# EAGLE design dev-board (EAGLE 7.1.0)
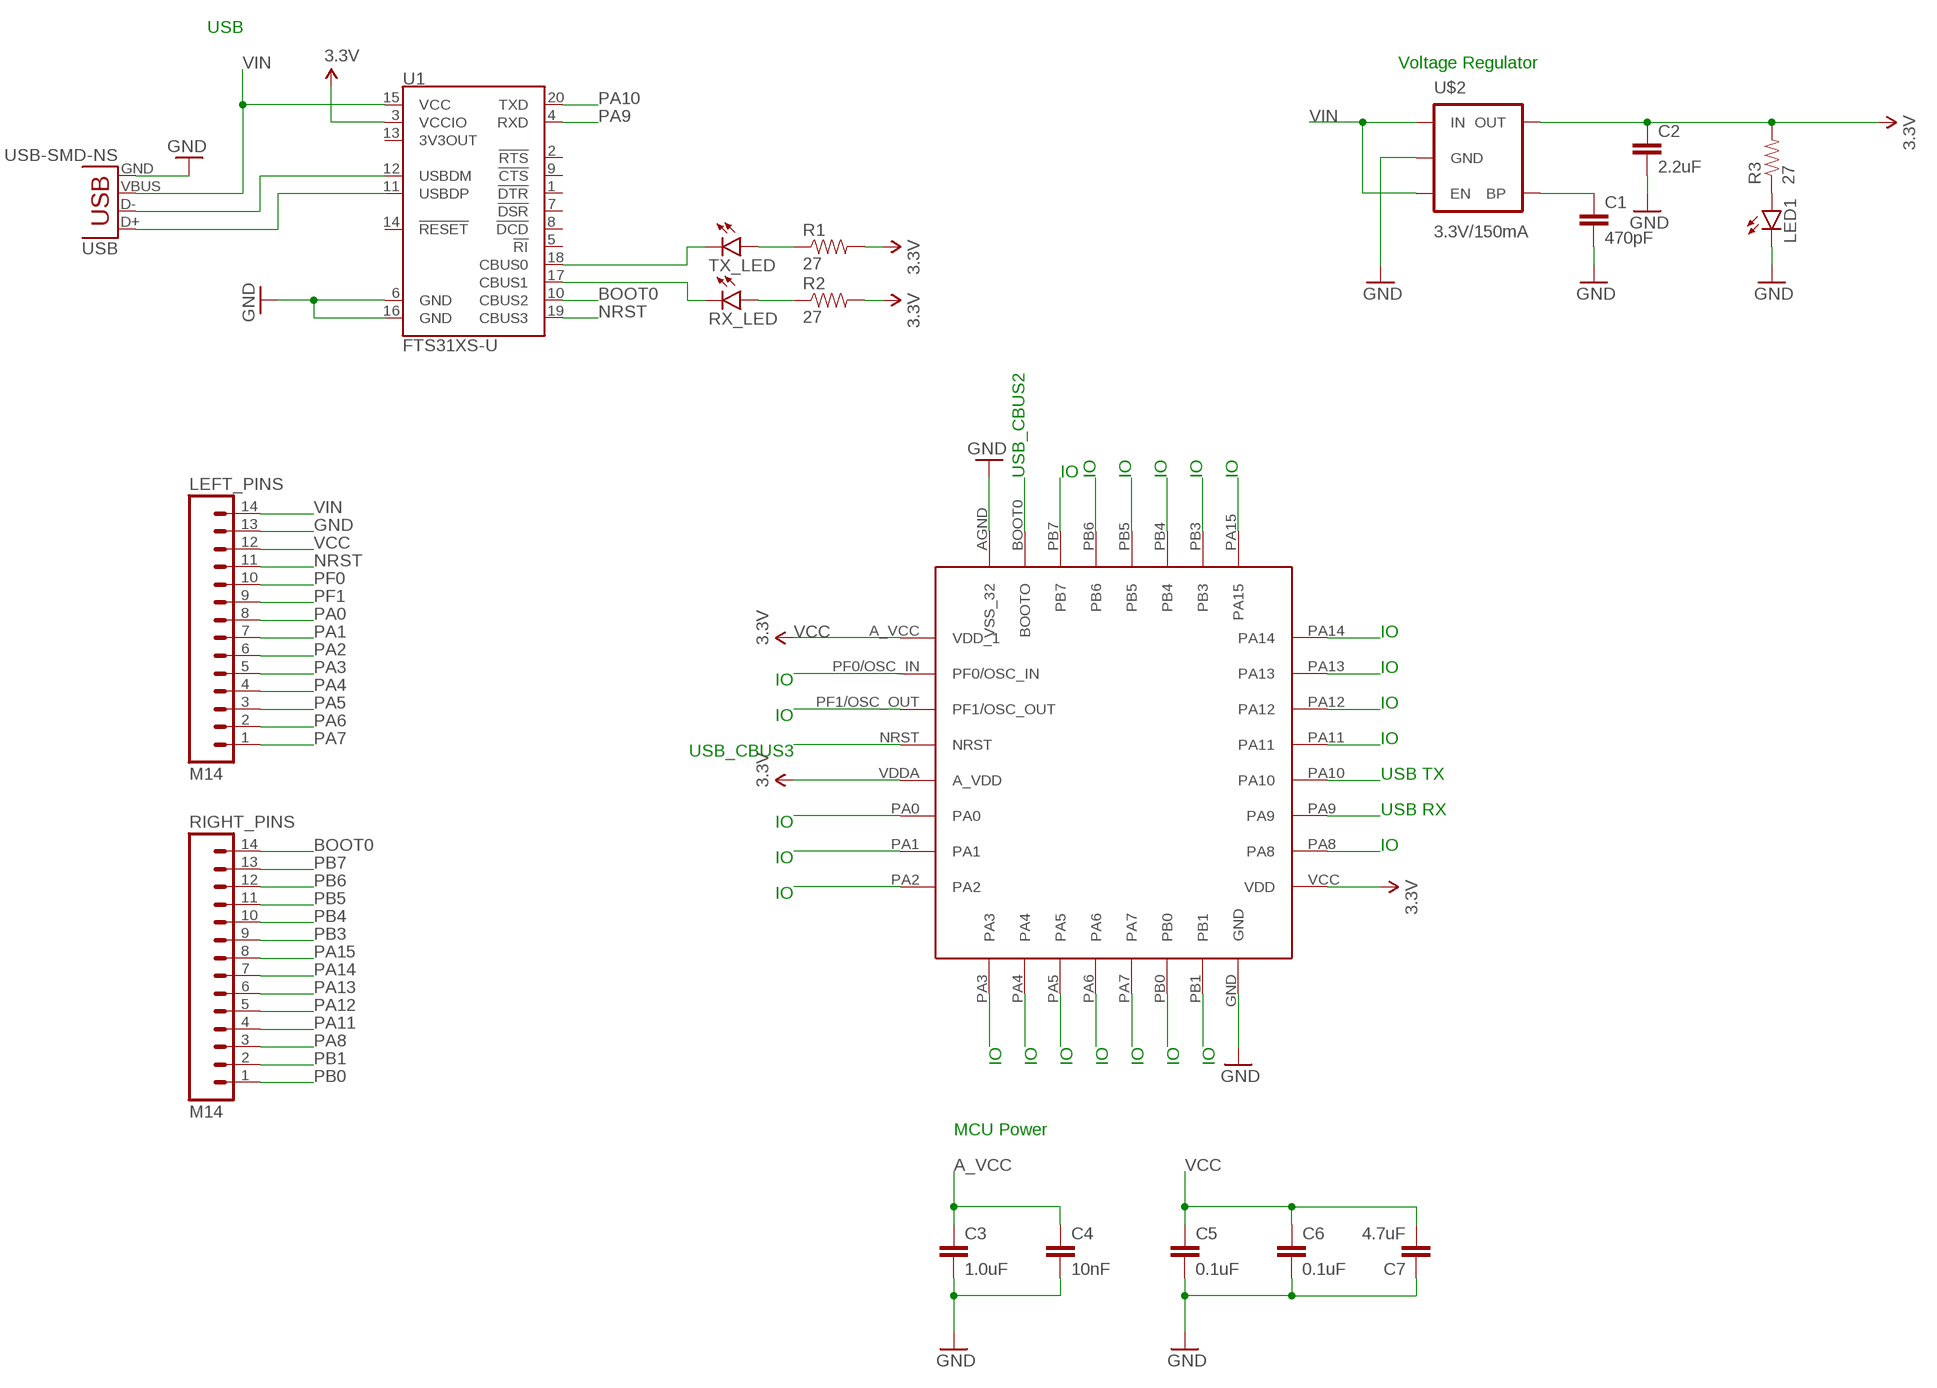
[diagram p0: schematic, sheet 1]

## Parts
C1  470pF  470PF-50V-5%(0603)SMD  [0603-CAP]
C2  2.2uF  2.2UF-10V-20%(0603)  [0603-CAP]
C3  1.0uF  1.0UF-16V-10%(0603)  [0603-CAP]
C4  10nF  10NF/10000PF-50V-10%(0603)  [0603-CAP]
C5  0.1uF  0.1UF-16V(+-10%)(0402)  [0402-CAP]
C6  0.1uF  0.1UF-16V(+-10%)(0402)  [0402-CAP]
C7  4.7uF  4.7UF-6.3V-10%(0603)0603  [0603-CAP]
LED1  LED1206  [LED-1206]
LEFT_PINS  M14  [1X14]
R1  27  27OHM1/10W1%(0603)  [0603]
R2  27  27OHM1/10W1%(0603)  [0603]
R3  27  27OHM1/10W1%(0603)  [0603]
RIGHT_PINS  M14  [1X14]
RX_LED  LED1206  [LED-1206]
TX_LED  LED1206  [LED-1206]
U1  FTS31XS-U  FT231XS  [SSOP20_L]
U$1  STM32F051XX  [STM32F051-LQFP-32]
U$2  3.3V/150mA  V_REG_MIC52053.3V  [SOT23-5]
USB  USB-SMD-NS  [USB-MINIB-NOSTOP]

## Nets
A_VCC: C3.1 C4.1 U$1.VDDA(A_VDD) ; supply symbol labelled 3.3V
BOOT0: RIGHT_PINS.14 U1.10(CBUS2) U$1.BOOT0(BOOTO)
GND: C1.2 C2.2 C3.2 C4.2 C5.2 C6.2 C7.1 LED1.C LEFT_PINS.13 U1.6(GND) U1.16(GND) U$1.AGND(VSS_32) U$1.GND U$2.2(GND) USB.GND
N$1: RX_LED.C U1.17(CBUS1)
N$2: TX_LED.C U1.18(CBUS0)
N$3: R1.1 TX_LED.A
N$4: R2.1 RX_LED.A
N$5: LED1.A R3.1
N$37: C1.1 U$2.4(BP)
NRST: LEFT_PINS.11 U1.19(CBUS3) U$1.NRST
PA0: LEFT_PINS.8 U$1.PA0
PA1: LEFT_PINS.7 U$1.PA1
PA2: LEFT_PINS.6 U$1.PA2
PA3: LEFT_PINS.5 U$1.PA3
PA4: LEFT_PINS.4 U$1.PA4
PA5: LEFT_PINS.3 U$1.PA5
PA6: LEFT_PINS.2 U$1.PA6
PA7: LEFT_PINS.1 U$1.PA7
PA8: RIGHT_PINS.3 U$1.PA8
PA9: U1.4(RXD) U$1.PA9
PA10: U1.20(TXD) U$1.PA10
PA11: RIGHT_PINS.4 U$1.PA11
PA12: RIGHT_PINS.5 U$1.PA12
PA13: RIGHT_PINS.6 U$1.PA13
PA14: RIGHT_PINS.7 U$1.PA14
PA15: RIGHT_PINS.8 U$1.PA15
PB0: RIGHT_PINS.1 U$1.PB0
PB1: RIGHT_PINS.2 U$1.PB1
PB3: RIGHT_PINS.9 U$1.PB3
PB4: RIGHT_PINS.10 U$1.PB4
PB5: RIGHT_PINS.11 U$1.PB5
PB6: RIGHT_PINS.12 U$1.PB6
PB7: RIGHT_PINS.13 U$1.PB7
PF0: LEFT_PINS.10 U$1.PF0/OSC_IN
PF1: LEFT_PINS.9 U$1.PF1/OSC_OUT
USB_D+: U1.11(USBDP) USB.D+
USB_D-: U1.12(USBDM) USB.D-
VCC: C2.1 C5.1 C6.1 C7.2 LEFT_PINS.12 R1.2 R2.2 R3.2 U1.3(VCCIO) U$1.A_VCC(VDD_1) U$1.VCC(VDD) U$2.5(OUT) ; supply symbol labelled 3.3V
VIN: LEFT_PINS.14 U1.15(VCC) U$2.1(IN) U$2.3(EN) USB.VBUS
Unconnected: U1.1(!DTR) U1.2(!RTS) U1.5(!RI) U1.7(!DSR) U1.8(!DCD) U1.9(!CTS) U1.13(3V3OUT) U1.14(!RESET)

## Notes on the sheet
- USB
- Voltage Regulator
- USB_CBUS2 | IO | IO | IO | IO | IO | IO
- IO
- IO | IO
- IO | IO
- USB_CBUS3 | IO
- USB TX
- IO | USB RX
- IO | IO
- IO
- IO | IO | IO | IO | IO | IO | IO
- MCU Power

## Library data of the parts
C1 = SparkFun-Capacitors:470PF-50V-5%(0603): CAP-07884; PROD_ID: CAP-07884
C2 = SparkFun-Capacitors:2.2UF-10V-20%(0603): CAP-07888; PROD_ID: CAP-07888
C3 = SparkFun-Capacitors:1.0UF-16V-10%(0603): CAP-00868; PROD_ID: CAP-00868
C4 = SparkFun-Capacitors:10NF/10000PF-50V-10%(0603): CAP-00867; PROD_ID: CAP-00867
C5 C6 = SparkFun-Capacitors:0.1UF-16V(+-10%)(0402); PROD_ID: CAP-12416
C7 = SparkFun-Capacitors:4.7UF-6.3V-10%(0603): CAP-08280; PROD_ID: CAP-08280
LED1 RX_LED TX_LED = SparkFun-LED:LED: LEDs Standard schematic elements and footprints for 5mm, 3mm, 1206, and 0603 sized LEDs. 5mm - Spark Fun Electronics SKU : COM-00529 (and others)
LEFT_PINS RIGHT_PINS = SparkFun-Connectors:M14: Header 14 Standard 14-pin 0.1" header. Use with straight break away headers (SKU : PRT-00116), right angle break away headers (PRT-00553), swiss pins (PRT-00743), machine pins (PRT-00117), and female headers (PRT-00115).
R1-R3 = SparkFun-Resistors:27OHM1/10W1%(0603): RES-09334; PROD_ID: RES-09334
U1 = SparkFun-DigitalIC:FT231X: FTDI FT231X Full Speed USB to Full-handshake UART This USB2.0 Full Speed IC offers a compact bridge to full handshake UART interfaces. The device is a UART, capable of operating up to 3MBaud, with low power consumption (8mA). The FT231X includes the complete FT-X series feature set and enables USB to be added into a system design quickly and easily over a UART interface.; PROD_ID: IC-11524
U$1 = jordan-lib:STM32F051XX
U$2 = SparkFun-PowerIC:V_REG_MIC5205: V_REG MIC5219 Standard 3.3V and 5V 150mA LDO voltage regulator in SOT-23 layout. Micrel part MIC5205. BP (by-pass) pin is used to lower output noise with 470pF cap, may be left open.; PROD_ID: VREG-00822
USB = SparkFun-Connectors:USB: USB Connectors USB-B-PTH is fully proven SKU : PRT-00139/CONN-08278 USB-miniB is fully proven SKU : PRT-00587 USB-A-PCB is untested. USB-A-H is throughly reviewed, but untested. Spark Fun Electronics SKU : PRT-00437 USB-B-SMT is throughly reviewed, but untested. Needs silkscreen touching up. USB-A-S has not been used/tested USB-MB-H has not been used/tested USB-MICROB has been used. CONN-09505

## Board
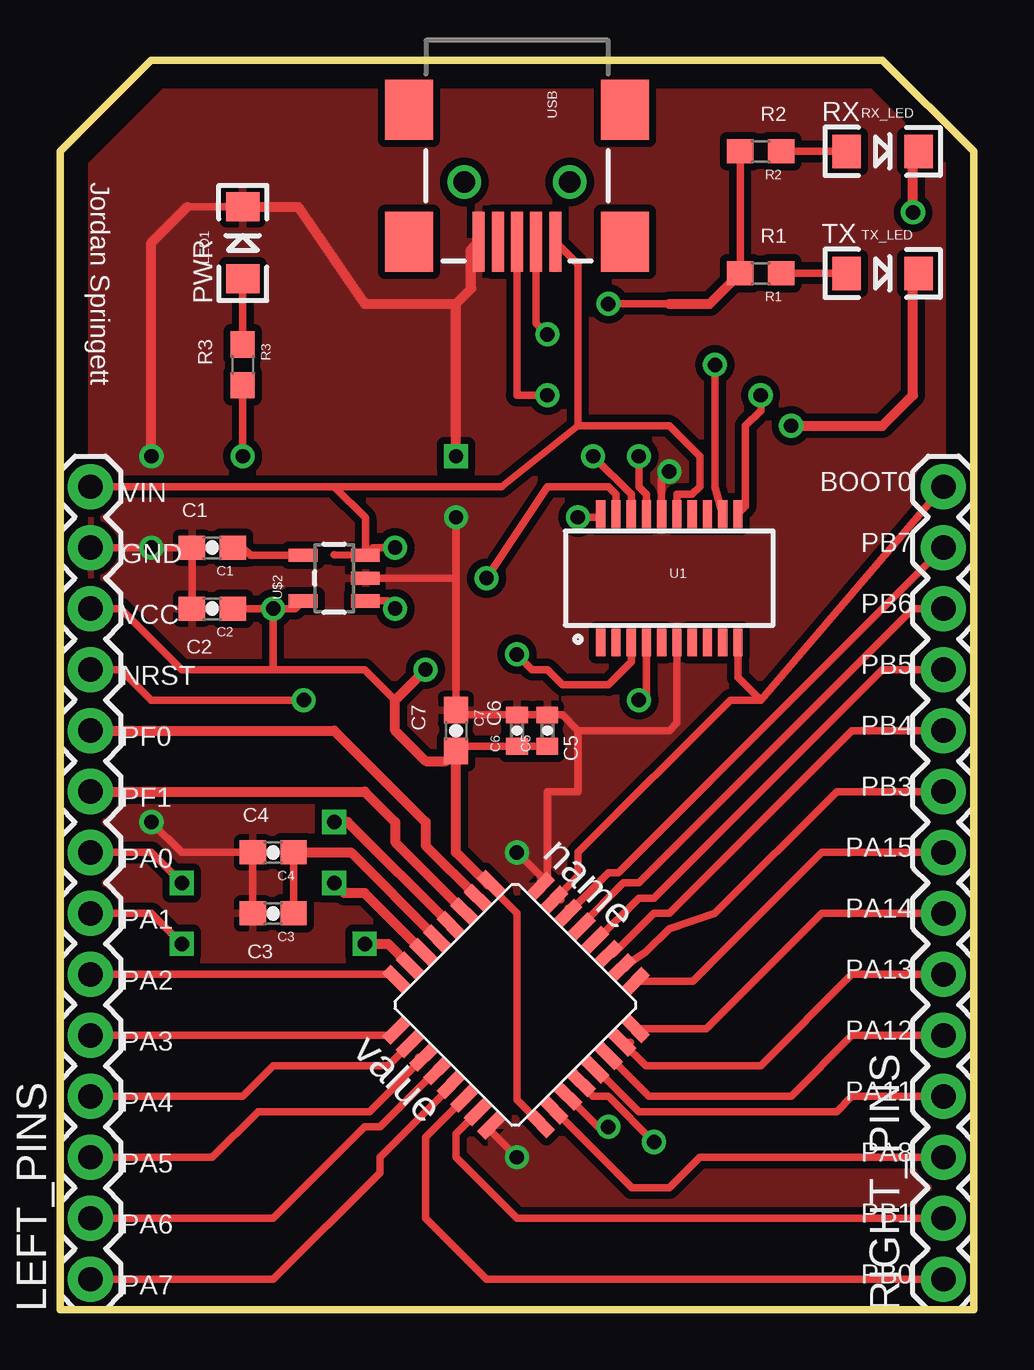
[diagram p1: board, top side]
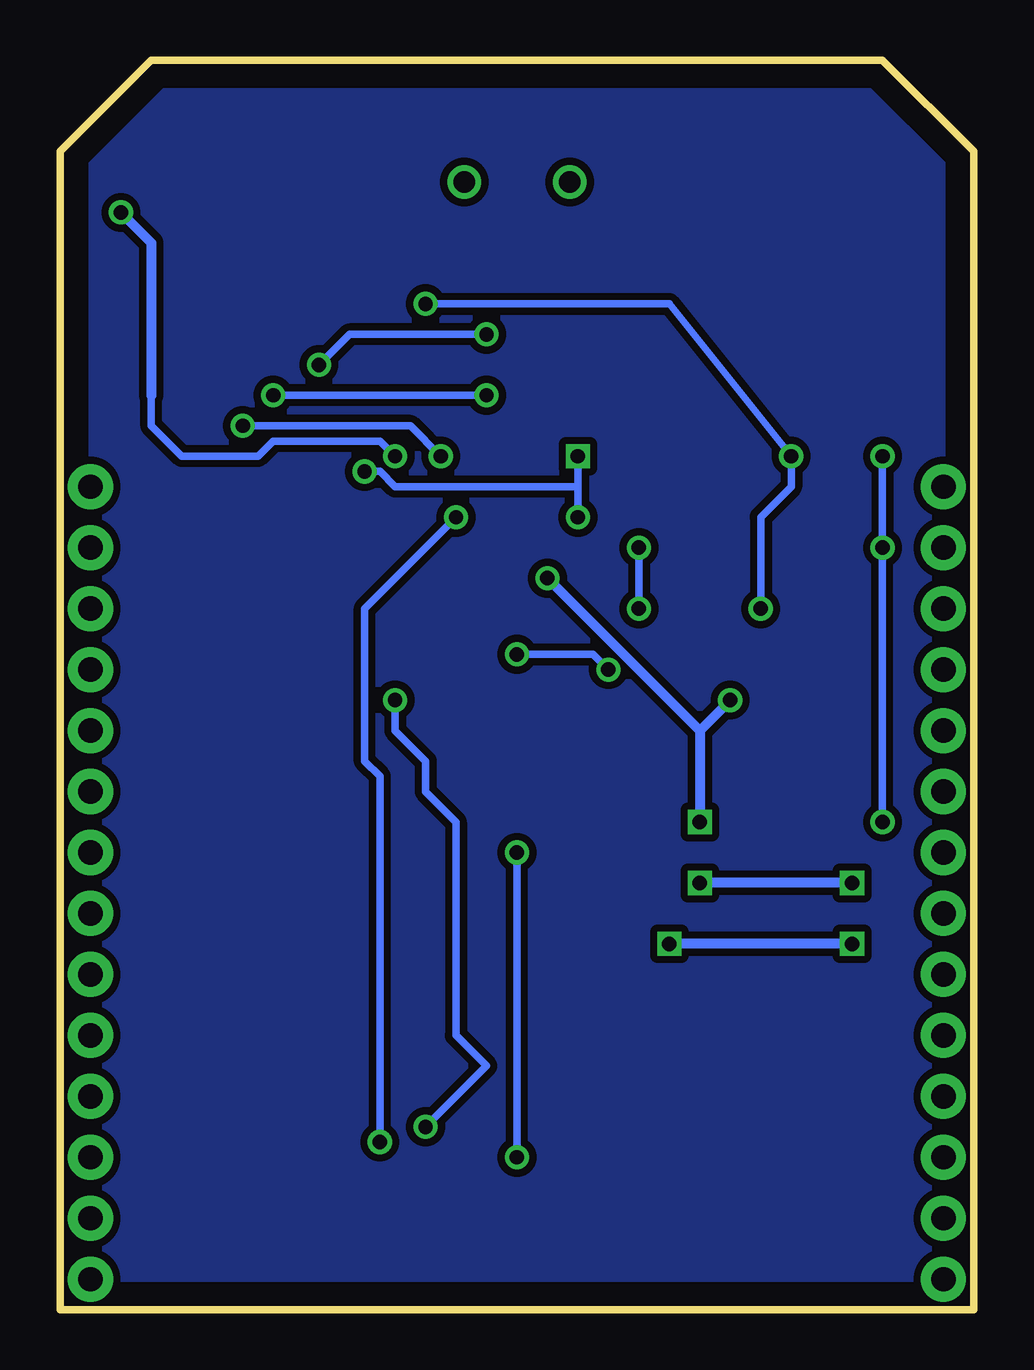
[diagram p2: board, bottom side, seen from below]

Size 38.1 x 52.07 mm. Coordinates in mm from the lower left corner, seen from the top.
Outline: 0,0 0,48.26 3.81,52.07 34.29,52.07 38.1,48.26 38.1,0 0,0
Copper layers (1*16): Top 0.035mm / dielectric 1.5mm / Bottom 0.035mm
Design rules "default": minimum track width 10mil, minimum drill 24mil, track to track 8mil, track to pad 8mil, pad to pad 8mil, via to via 8mil, smd to smd 8mil, copper to edge 40mil, drill to drill 8mil, minimum pad ring 10mil, minimum via ring 8mil, stop-mask expansion 4mil, vias tented up to drill 0mil, thermal gap 10mil

### Footprints (pad centres in the part's own frame; a part is rotated, then mirrored left to right if it is on the bottom)
0603-CAP = smd 1.1 x 1: 1 -0.85,0; 2 0.85,0
0402-CAP = smd 0.7 x 0.9: 1 -0.65,0; 2 0.65,0
LED-1206 = smd 1.2 x 1.4: A -1.5,0; C 1.5,0
1X14 = drill 1.016 pad 1.88: 1 0,0; 2 2.54,0; 3 5.08,0; 4 7.62,0; 5 10.16,0; 6 12.7,0; 7 15.24,0; 8 17.78,0; 9 20.32,0; 10 22.86,0; 11 25.4,0; 12 27.94,0; 13 30.48,0; 14 33.02,0
0603 = smd 1.1 x 1: 1 -0.85,0; 2 0.85,0
SSOP20_L = smd 0.381 x 1.143: 1 -2.857,-2.68; 2 -2.223,-2.68; 3 -1.587,-2.68; 4 -0.953,-2.68; 5 -0.318,-2.68; 6 0.318,-2.68; 7 0.953,-2.68; 8 1.587,-2.68; 9 2.223,-2.68; 10 2.857,-2.68; 11 2.857,2.68; 12 2.223,2.68; 13 1.587,2.68; 14 0.953,2.68; 15 0.318,2.68; 16 -0.318,2.68; 17 -0.953,2.68; 18 -1.587,2.68; 19 -2.223,2.68; 20 -2.857,2.68
STM32F051-LQFP-32 = smd 1.2 x 0.5: A_VCC -4.3,2.8; NRST -4.3,0.4; PA0 -4.3,-1.2; PA1 -4.3,-2; PA2 -4.3,-2.8; PA8 4.2,-2; PA9 4.2,-1.2; PA10 4.2,-0.4; PA11 4.2,0.4; PA12 4.2,1.2; PA13 4.2,2; PA14 4.2,2.8; PF0/OSC_IN -4.3,2; PF1/OSC_OUT -4.3,1.2; VCC 4.2,-2.8; VDDA -4.3,-0.4 | smd 0.5 x 1.2: AGND -2.8,4.2; BOOT0 -2,4.2; GND 2.8,-4.3; PA3 -2.8,-4.3; PA4 -2,-4.3; PA5 -1.2,-4.3; PA6 -0.4,-4.3; PA7 0.4,-4.3; PA15 2.8,4.2; PB0 1.2,-4.3; PB1 2,-4.3; PB3 2,4.2; PB4 1.2,4.2; PB5 0.4,4.2; PB6 -0.4,4.2; PB7 -1.2,4.2
SOT23-5 = smd 0.55 x 1.2: 1 -0.95,-1.3; 2 0,-1.3; 3 0.95,-1.3; 4 0.95,1.3; 5 -0.95,1.3
USB-MINIB-NOSTOP = smd 2.5 x 0.5: D+ 2.5,0; D- 2.5,0.8; GND 2.5,-1.6; ID 2.5,-0.8; VBUS 2.5,1.6 | smd 2.5 x 2: G1 -3,-4.5; G2 -3,4.5; G3 2.5,4.5; G4 2.5,-4.5 | drill 0.9 pad 0.8: H1 0,2.2 | drill 0.9 pad 0.787: H2 0,-2.2

### Placement (x,y rotation side)
C1  6.35,31.75 180 top
C2  6.35,29.21 180 top
C3  8.89,16.51 180 top
C4  8.89,19.05 180 top
C5  20.32,24.13 90 top
C6  19.05,24.13 90 top
C7  16.51,24.13 270 top
LED1  7.62,44.45 90 top
LEFT_PINS  1.27,1.27 90 top
R1  29.21,43.18 180 top
R2  29.21,48.26 180 top
R3  7.62,39.37 270 top
RIGHT_PINS  36.83,1.27 90 top
RX_LED  34.29,48.26 0 top
TX_LED  34.29,43.18 0 top
U1  25.4,30.48 0 top
U$1  19.05,12.7 315 top
U$2  11.43,30.48 90 top
USB  19.05,46.99 270 top

### Tracks (layer width: path | path; a pad name or v marks a point on that pad's centre or on a via)
A_VCC
  Top 0.305: C4.1 C3.1
  Top 0.406: C4.1 12.13,19.05 U$1.VDDA
BOOT0
  Top 0.305: 20.89,17.08 U$1.BOOT0 21.59,18.07 21.59,19.05 27.94,25.4 29.21,25.4 | 29.21,25.4 RIGHT_PINS.14 | U1.10 28.26,26.35 29.21,25.4
GND  (via drill 0.6, 0.6 pad 0.3)
  Top 0.305: C2.2 C1.2 v3.81,31.75 LEFT_PINS.13 | LED1.C 5.31,45.95 | U$1.GND 17.99,7.41 v19.05,6.35 | v19.05,19.05 20.32,17.78 20.17,17.78 U$1.AGND 20.32,17.93 20.32,21.59 21.59,21.59 21.59,24.13 | 21.59,24.13 20.94,24.78 C5.2 C6.2 | C6.2 16.71,24.78 C7.1 16.51,30.48 | C3.2 C4.2 5.08,19.05 v3.81,20.32 | U1.6 25.72,24.45 25.4,24.13 21.59,24.13 | v25.4,34.92 25.08,34.61 U1.16 | v16.51,33.02 16.51,30.48 | 16.51,30.48 U$2.2 | C6.2 18.85,24.98
  Top 0.406: v3.81,35.56 3.81,44.45 5.31,45.95 | LED1.C 9.93,45.95 12.7,41.91 16.51,41.91 | 16.51,41.91 17.15,42.54 17.15,44.18 USB.GND | v16.51,35.56 16.51,41.91
  Bottom 0.305: v3.81,35.56 v3.81,31.75 v3.81,20.32 | v19.05,6.35 v19.05,19.05 | 16.51,34.29 24.13,34.29 24.77,34.92 v25.4,34.92 | v16.51,35.56 16.51,34.29 | 16.51,34.29 v16.51,33.02
  pour Top (isolate 0.305): 0,48.26 3.81,52.07 34.29,52.07 38.1,48.26 38.1,0 0,0
N$1  (via drill 0.6)
  Top 0.305: v24.13,35.56 24.13,34.29 24.45,33.97 U1.17
  Top 0.406: v35.56,45.72 35.56,48.03 RX_LED.C
  Bottom 0.305: v24.13,35.56 24.77,36.2 29.21,36.2 29.84,35.56 33.02,35.56 34.29,36.83 34.29,38.1
  Bottom 0.406: v35.56,45.72 34.29,44.45 34.29,38.1
N$2  (via drill 0.6)
  Top 0.305: v22.23,35.56 23.81,33.97 U1.18
  Top 0.406: v30.48,36.83 34.29,36.83 35.56,38.1 35.56,42.95 TX_LED.C
  Bottom 0.305: v30.48,36.83 23.49,36.83 v22.23,35.56
N$3
  Top 0.305: TX_LED.A R1.1
N$4
  Top 0.305: R2.1 RX_LED.A
N$5
  Top 0.305: LED1.A R3.1
N$6
  pour Bottom (isolate 0.305): 0,0 38.1,0 38.1,48.26 34.29,52.07 3.81,52.07 0,48.26
N$8  (via drill 0.6)
  other vias: 16.51,35.56
N$37
  Top 0.305: U$2.4 7.94,31.43 7.62,31.75 C1.1
NRST  (via drill 0.6)
  Top 0.305: U1.19 23.18,33.97 22.86,34.29 20.32,34.29 v17.78,30.48 | LEFT_PINS.11 2.54,26.67 3.81,25.4 v10.16,25.4
  Top 0.406: 16.29,16.09 U$1.NRST 12,20.32 v11.43,20.32
  Bottom 0.406: v10.16,25.4 11.43,24.13 | 11.43,24.13 v11.43,20.32 | 11.43,24.13 v17.78,30.48
PA0  (via drill 0.6)
  Top 0.305: LEFT_PINS.8 3.81,19.05 v5.08,17.78
  Top 0.406: U$1.PA0 12.7,17.35 11.86,17.35 v11.43,17.78
  Bottom 0.406: v5.08,17.78 v11.43,17.78
PA1  (via drill 0.6)
  Top 0.305: LEFT_PINS.7 3.81,16.51 v5.08,15.24
  Top 0.406: v12.7,15.24 13.68,15.24 U$1.PA1
  Bottom 0.406: v5.08,15.24 v12.7,15.24
PA2
  Top 0.305: LEFT_PINS.6 13.82,13.97 U$1.PA2
PA3
  Top 0.305: LEFT_PINS.5 13.82,11.43 U$1.PA3
PA4
  Top 0.305: LEFT_PINS.4 7.62,8.89 8.89,10.16 13.68,10.16 U$1.PA4
PA5
  Top 0.305: 14.95,10.51 U$1.PA5 12.91,8.26 8.26,8.26 6.35,6.35 LEFT_PINS.3
PA6
  Top 0.305: U$1.PA6 15.66,9.94 13.34,7.62 12.7,7.62 8.89,3.81 LEFT_PINS.2
PA7
  Top 0.305: U$1.PA7 16.29,9.31 13.34,6.35 13.34,5.71 8.89,1.27 LEFT_PINS.1
PA8
  Top 0.305: U$1.PA8 23.84,5.08 25.4,5.08 26.67,6.35 RIGHT_PINS.3
PA9  (via drill 0.6)
  Top 0.305: U1.4 24.45,25.4 v24.13,25.4 | v22.86,7.62 22.43,7.62 U$1.PA9
  Bottom 0.305: v24.13,25.4 24.13,24.13 22.86,22.86 22.86,21.59 21.59,20.32 21.59,11.43 20.32,10.16 v22.86,7.62
PA10  (via drill 0.6)
  Top 0.305: U$1.PA10 21.74,9.38 22.23,8.89 22.86,8.89 v24.77,6.99 | v21.59,33.02 22.4,33.02 U1.20
  Bottom 0.305: v24.77,6.99 24.77,22.23 25.4,22.86 25.4,29.21 v21.59,33.02
PA11
  Top 0.305: U$1.PA11 22.37,10.01 24.13,8.26 32.39,8.26 33.02,8.89 RIGHT_PINS.4
PA12
  Top 0.305: RIGHT_PINS.5 33.02,11.43 30.48,8.89 24.56,8.89 U$1.PA12
PA13
  Top 0.305: 23.78,11.14 U$1.PA13 24.42,10.16 29.21,10.16 33.02,13.97 RIGHT_PINS.6
PA14
  Top 0.305: U$1.PA14 26.95,11.71 31.75,16.51 RIGHT_PINS.7
PA15
  Top 0.305: U$1.PA15 26.39,13.69 31.75,19.05 RIGHT_PINS.8
PB0
  Top 0.305: RIGHT_PINS.1 17.78,1.27 15.24,3.81 15.24,7.19 U$1.PB0
PB1
  Top 0.305: U$1.PB1 16.51,7.33 16.51,6.35 19.05,3.81 RIGHT_PINS.2
PB3
  Top 0.305: U$1.PB3 24.42,14.89 25.4,15.87 27.3,16.51 32.39,21.59 RIGHT_PINS.9
PB4
  Top 0.305: U$1.PB4 23.08,14.82 24.77,16.51 25.4,16.51 33.02,24.13 RIGHT_PINS.10
PB5
  Top 0.305: U$1.PB5 22.37,15.39 24.13,17.14 24.77,17.14 34.29,26.67 RIGHT_PINS.11
PB6
  Top 0.305: U$1.PB6 21.74,16.02 23.49,17.78 24.13,17.78 35.56,29.21 RIGHT_PINS.12
PB7
  Top 0.305: 21.17,16.73 U$1.PB7 22.86,18.21 23.29,18.21 RIGHT_PINS.13
PF0
  Top 0.406: U$1.PF0/OSC_IN 15.24,19.34 15.24,20.32 11.43,24.13 LEFT_PINS.10
PF1
  Top 0.406: LEFT_PINS.9 12.7,21.59 13.97,20.32 13.97,19.48 U$1.PF1/OSC_OUT
USB_D+  (via drill 0.6)
  Top 0.305: USB.D+ 19.05,38.1 v20.32,38.1 | v29.21,38.1 29.21,37.46 28.58,36.83 28.58,33.48 U1.11
  Bottom 0.305: v20.32,38.1 v29.21,38.1
USB_D-  (via drill 0.6)
  Top 0.305: USB.D- 19.85,41.11 v20.32,40.64 | v27.3,39.37 27.3,34.29 U1.12
  Bottom 0.305: v20.32,40.64 26.03,40.64 v27.3,39.37
VCC  (via drill 0.6, 0.6 pad 0.3)
  Top 0.305: R3.2 v7.62,35.56 | R1.2 R2.2 | U$1.A_VCC 17.99,17.57 19.05,16.51 19.05,8.74 U$1.VCC | C5.1 C6.1 16.71,23.48 C7.2 16.09,22.86 | 25.4,41.91 v22.86,41.91 | U1.3 23.81,26.99 22.86,26.03 20.95,26.03 20.32,26.67 19.69,26.67 v19.05,27.3 | LEFT_PINS.12 2.54,29.21 5.08,26.67 8.89,26.67 | U$2.5 9.81,29.21 v8.89,29.21 | v8.89,29.21 C2.1 | 8.89,26.67 v8.89,29.21 | 13.97,25.4 12.7,26.67 8.89,26.67
  Top 0.406: 25.4,41.91 27.09,41.91 R1.2 | U$1.A_VCC 17.84,17.72 16.51,19.05 C7.2 | 16.09,22.86 15.24,22.86 13.97,24.13 13.97,25.4 v15.24,26.67
  Bottom 0.305: v22.86,41.91 12.7,41.91 v7.62,35.56 7.62,34.29 8.89,33.02 v8.89,29.21 | v19.05,27.3 15.88,27.3 v15.24,26.67
VIN  (via drill 0.6 pad 0.3)
  Top 0.305: 11.43,31.46 U$2.3 | 11.43,34.29 18.41,34.29 21.59,36.83 | 11.43,34.29 LEFT_PINS.14 | 21.59,36.83 21.59,43.55 USB.VBUS | 21.59,36.83 25.4,36.83 26.67,35.56 26.67,34.29 26.35,33.97 25.72,33.97 U1.15 | U$2.3 13.05,31.75 v13.97,31.75 | v13.97,29.21 13.65,29.53 U$2.1 | 11.43,34.29 12.73,32.99 U$2.3
  Bottom 0.305: v13.97,31.75 v13.97,29.21

### Text on the board
tPlace: R2 | RX | Jordan Springett | R1 | TX | PWR | R3 | BOOT0 | VIN | C1 | PB7 | GND | PB6 | VCC | C2 | PB5 | NRST | C6 | PB4 | PF0 | C7 | C5 | PB3 | PF1 | C4 | PA15 | PA0 | PA14 | PA1 | C3 | PA13 | PA2 | PA12 | PA3 | PA11 | PA4 | PA8 | PA5 | PB1 | PA6 | PB0 | PA7